# Altium schematic sheet power.SchDoc
size A4; SheetNumber: 1; SheetTotal: 8
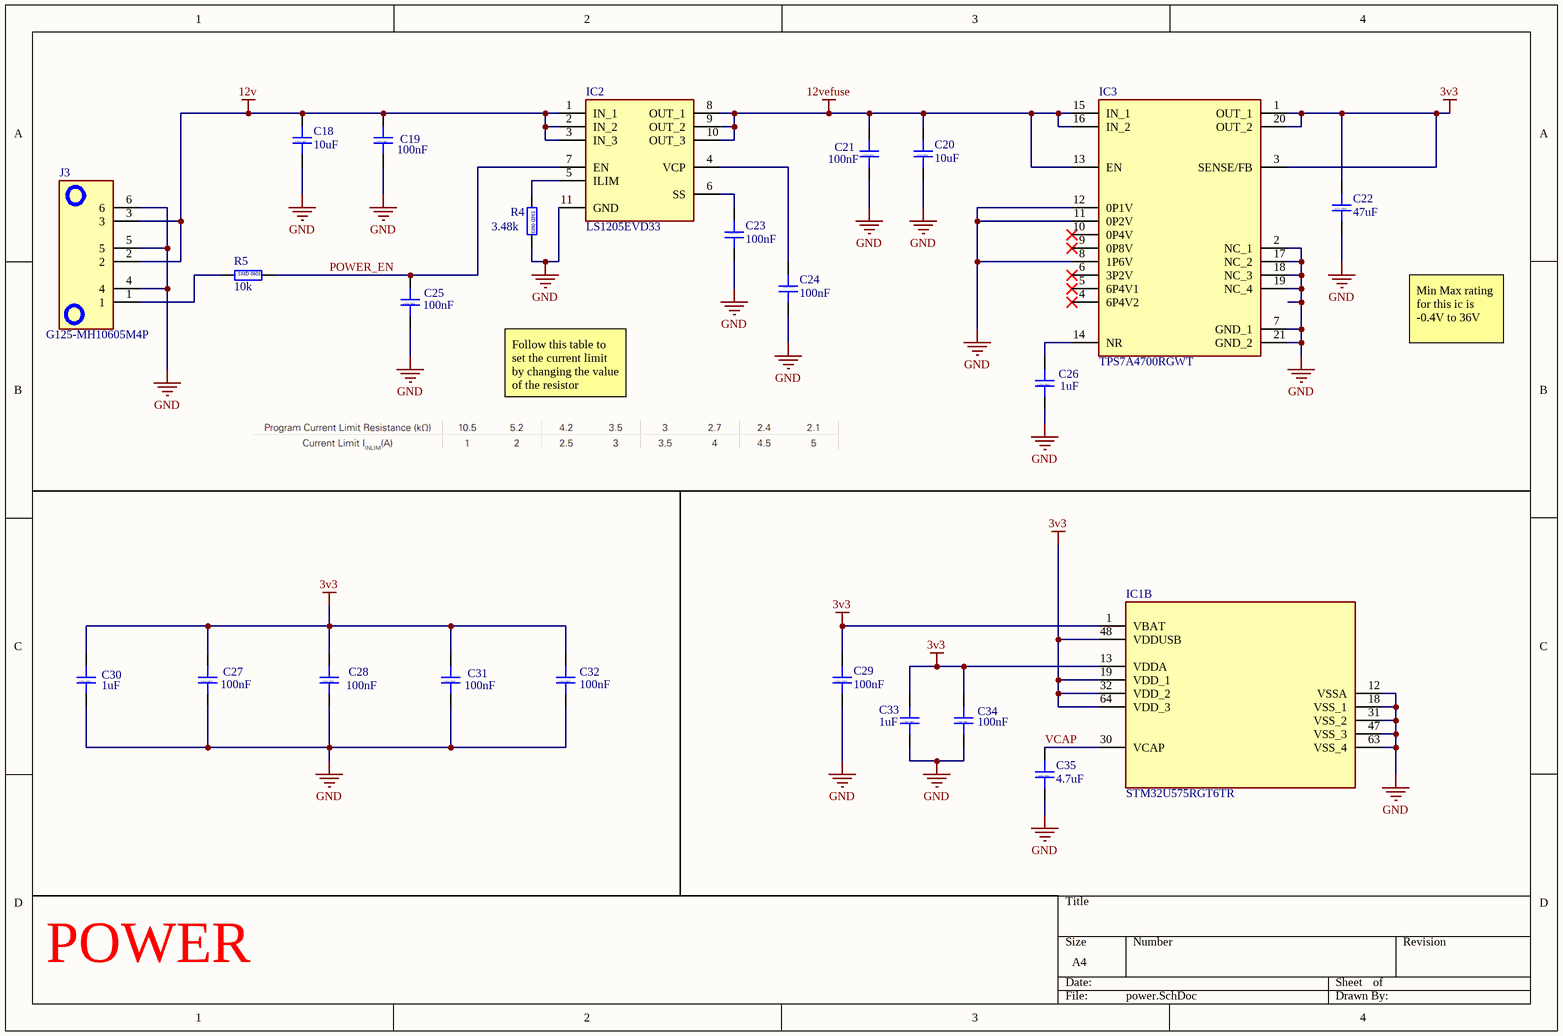
[diagram p0: power.SchDoc]

## Parts
C18  10uF  [CAP_0805]
C19  100nF  [CAP_0603]
C20  10uF  [CAP_0805]
C21  100nF  [CAP_0603]
C22  47uF  [CAP_1210]
C23  100nF  [CAP_0603]
C24  100nF  [CAP_0603]
C25  100nF  [CAP_0603]
C26  1uF  [CAP_0603]
C27  100nF  [CAP_0603]
C28  100nF  [CAP_0603]
C29  100nF  [CAP_0603]
C30  1uF  [CAP_0603]
C31  100nF  [CAP_0603]
C32  100nF  [CAP_0603]
C33  1uF  [CAP_0603]
C34  100nF  [CAP_0603]
C35  4.7uF  [CAP_0603]
IC1  STM32U575RGT6TR  [QFP50P1200X1200X160-64N]  (part B of 2)
IC2  LS1205EVD33  [LS1205EVD33]
IC3  TPS7A4700RGWT  [QFN65P500X500X100-21N-D]
J3  G125-MH10605M4P  [G125-MH10605M4P_1]
R4  3.48k  [RES_0603]
R5  10k  [RES_0603]

## Nets
3v3: C22.2 C27.2 C28.2 C29.2 C30.2 C31.2 C32.2 C33.2 C34.2 IC1.1(VBAT) IC1.13(VDDA) IC1.19(VDD_1) IC1.32(VDD_2) IC1.48(VDDUSB) IC1.64(VDD_3) IC3.1(OUT_1) IC3.3(SENSE/FB) IC3.20(OUT_2)
12v: C18.2 C19.2 IC2.1(IN_1) IC2.2(IN_2) IC2.3(IN_3) J3.2 J3.3
12vefuse: C20.2 C21.2 IC2.8(OUT_1) IC2.9(OUT_2) IC2.10(OUT_3) IC3.13(EN) IC3.15(IN_1) IC3.16(IN_2)
GND: C18.1 C19.1 C20.1 C21.1 C22.1 C23.2 C24.2 C25.1 C26.1 C27.1 C28.1 C29.1 C30.1 C31.1 C32.1 C33.1 C34.1 C35.1 IC1.12(VSSA) IC1.18(VSS_1) IC1.31(VSS_2) IC1.47(VSS_3) IC1.63(VSS_4) IC2.11(GND) IC3.2(NC_1) IC3.7(GND_1) IC3.8(1P6V) IC3.11(0P2V) IC3.12(0P1V) IC3.17(NC_2) IC3.18(NC_3) IC3.19(NC_4) IC3.21(GND_2) J3.4 J3.5 J3.6 R4.2
POWER_EN: C25.2 IC2.7(EN) R5.2
VCAP: C35.2 IC1.30(VCAP)
NetC23_1: C23.1 IC2.6(SS)
NetC24_1: C24.1 IC2.4(VCP)
NetC26_2: C26.2 IC3.14(NR)
NetIC2_5: IC2.5(ILIM) R4.1
NetJ3_1: J3.1 R5.1

Not connected (* = marked no-connect by the designer): IC3 4(6P4V2)* 5(6P4V1)* 6(3P2V)* 9(0P8V)* 10(0P4V)*

## Notes on the sheet
- Min Max rating for this ic is -0.4V to 36V
- Follow this table to set the current limit by changing the value of the resistor
- POWER
- (in symbol Capacitor-SMD-0603) SMD 0603
- (in symbol Capacitor-SMD-0805) SMD 0805
- (in symbol Capacitor-SMD-1210) SMD 1210
- (in symbol Resistor-SMD-0603) SMD 0603

## Library data of the parts
C18 C20 = Capacitor-SMD-0805: Capacitor SMD 0805 RATED
C19 C21 C23-C35 = Capacitor-SMD-0603: Capacitor SMD 0603 RATED
C22 = Capacitor-SMD-1210: Capacitor SMD 1210 RATED
IC1 = STM32U575RGT6TR: Integrated Circuit; Manufacturer_Name: STMicroelectronics; Datasheet Link: https://www.st.com/resource/en/datasheet/stm32u575ag.pdf; Height: 1.6mm; Manufacturer_Part_Number: STM32U575RGT6TR; Mouser Part Number: 511-STM32U575RGT6TR; Mouser Price/Stock: https://www.mouser.co.uk/ProductDetail/STMicroelectronics/STM32U575RGT6TR?qs=T%252BzbugeAwjjwoz%252BinJLUwQ%3D%3D; Arrow Part Number: STM32U575RGT6TR; Arrow Price/Stock: https://www.arrow.com/en/products/stm32u575rgt6tr/stmicroelectronics?utm_currency=USD&region=nac
IC2 = LS1205EVD33: Integrated Circuit; Manufacturer_Name: LITTELFUSE; Datasheet Link: https://www.littelfuse.com/media?resourcetype=datasheets&itemid=b40a8809-c1ad-459d-a34c-84532dbddcb7&filename=littelfuse-protection-ic-ls1205exd33--datasheet; Height: 0.8mm; Manufacturer_Part_Number: LS1205EVD33; Mouser Part Number: 576-LS1205EVD33; Mouser Price/Stock: https://www.mouser.co.uk/ProductDetail/Littelfuse/LS1205EVD33?qs=4ASt3YYao0VRtislHe5uQQ%3D%3D; Arrow Part Number: LS1205EVD33; Arrow Price/Stock: https://www.arrow.com/en/products/ls1205evd33/littelfuse?utm_currency=USD&region=nac
IC3 = TPS7A4700RGWR: Integrated Circuit; Manufacturer_Name: Texas Instruments; Datasheet Link: http://www.ti.com/lit/gpn/tps7a47; Height: 1mm; Manufacturer_Part_Number: TPS7A4700RGWR; Mouser Part Number: 595-TPS7A4700RGWR; Mouser Price/Stock: https://www.mouser.co.uk/ProductDetail/Texas-Instruments/TPS7A4700RGWR?qs=b5Ofe9I6AaEq0TfoG6v9lA%3D%3D; Arrow Part Number: TPS7A4700RGWR; Arrow Price/Stock: https://www.arrow.com/en/products/tps7a4700rgwr/texas-instruments?region=nac
J3 = G125-MH10605M4P: Connector; Manufacturer_Name: Harwin; Datasheet Link: https://content.harwin.com/m/667f1be9427fb768/original/DRG-02921-Technical-Drawing-Datasheet-G125-MH1XX05M4P-pdf.pdf; Height: 5.3mm; Manufacturer_Part_Number: G125-MH10605M4P; Mouser Part Number: 855-G125MH1065M4PM4P; Mouser Price/Stock: https://www.mouser.co.uk/ProductDetail/Harwin/G125-MH10605M4P?qs=vHuUswq2%252BswF07IXFR1W6A%3D%3D
R4 R5 = Resistor-SMD-0603: Resistor SMD 0603 RATED